# EAGLE design StickLogger (EAGLE 7.2.0)
CNAME: µArduino; CREVISION: 1.0; DATE: 28.04.2015; DESIGNER: Prajwal Bhattaram
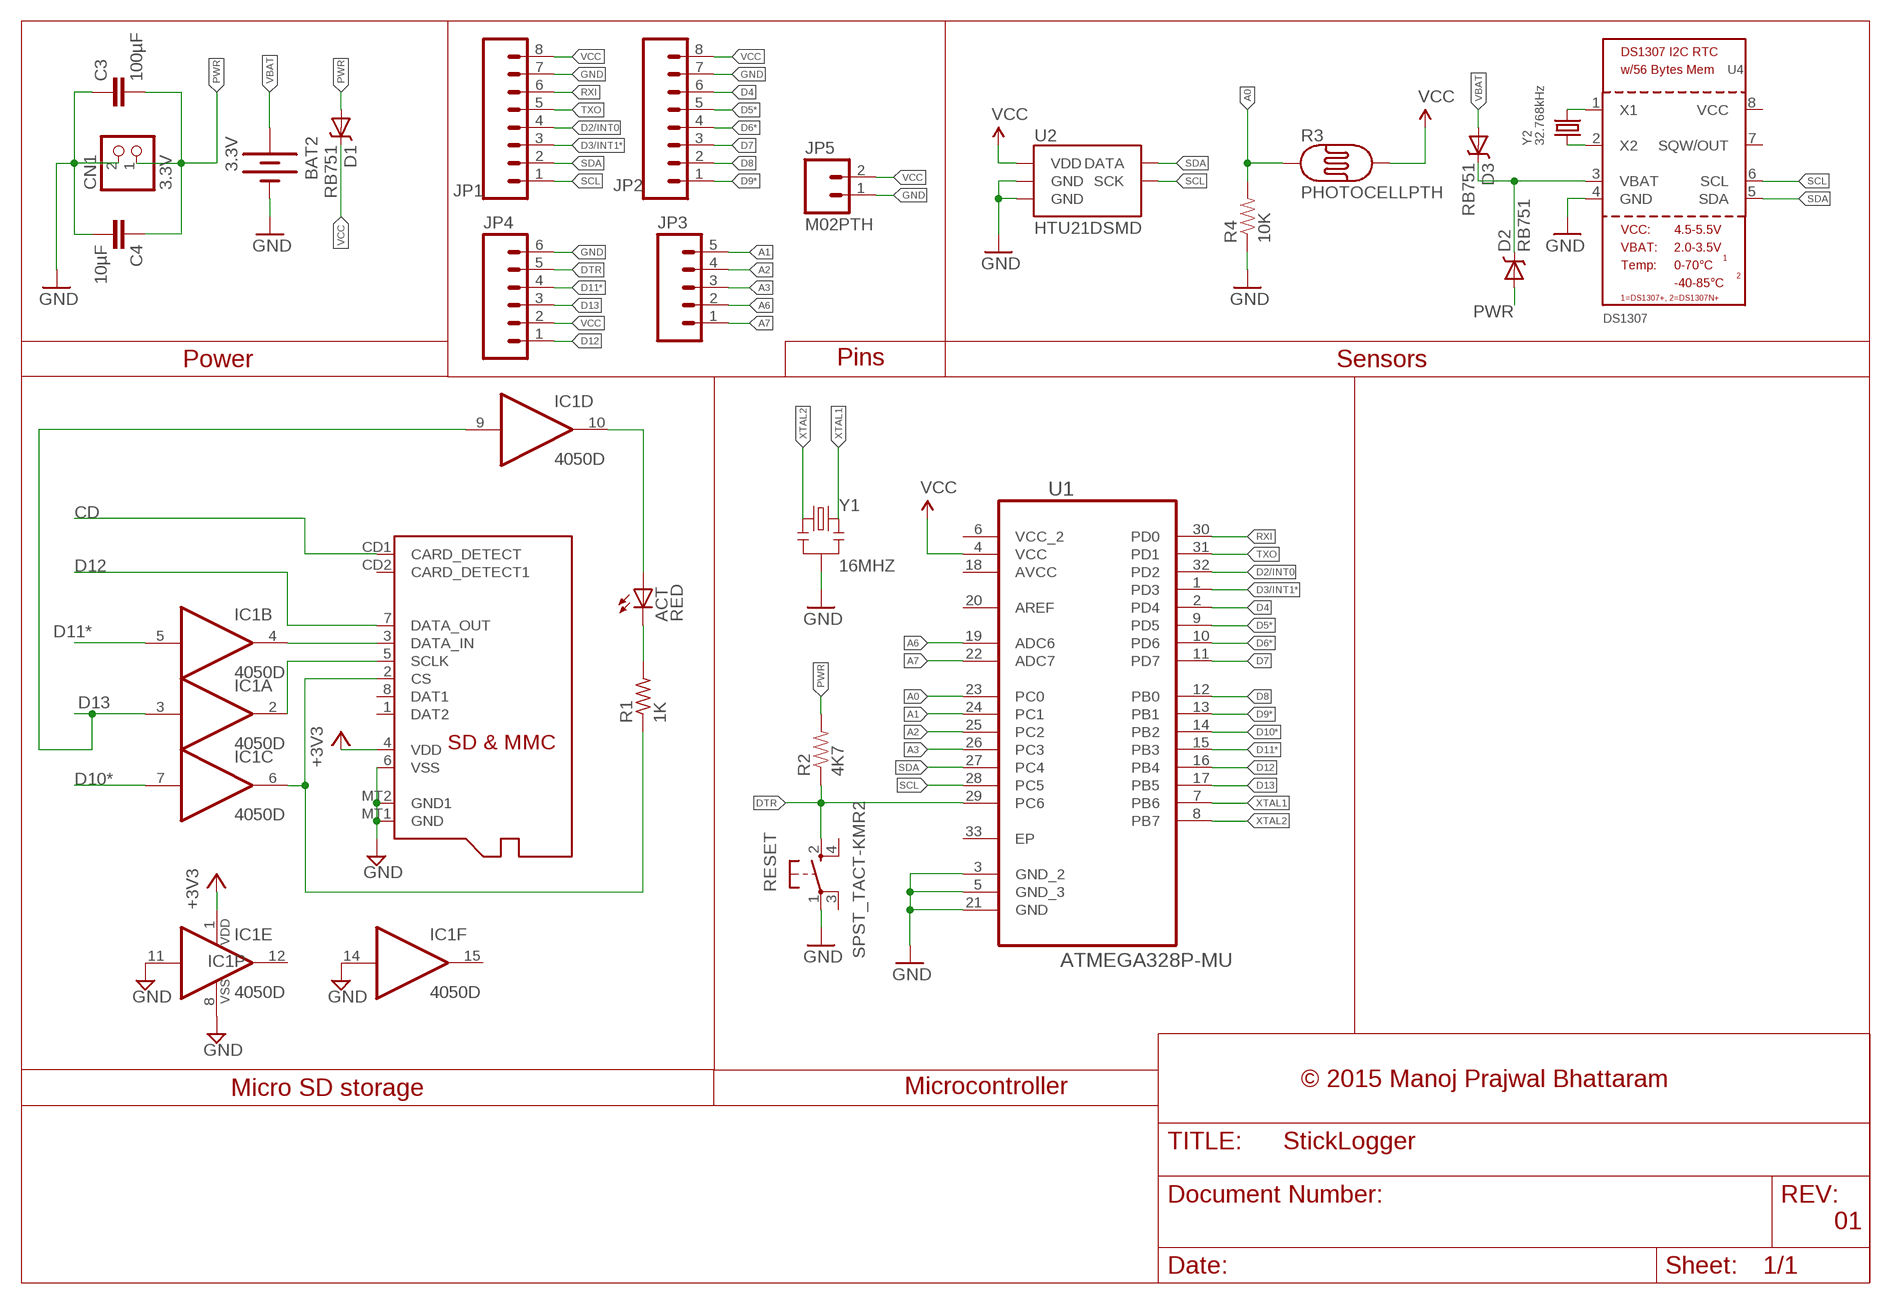
[diagram p0: schematic, sheet 1]

## Parts
ACT  RED  LEDCHIP-LED0805  [CHIP-LED0805]
BAT2  3.3V  BATTERY12MM  [BATTCON_12MM]
C3  100µF  CAP0402-CAP  [0402-CAP]
C4  10µF  CAP0402-CAP  [0402-CAP]
CN1  3.3V  JST_2PIN-SMT-RA  [JST-PH-2-SMT-RA]
D1  RB751  DIODE-SCHOTTKY-RB751  [SOD-523]
D2  RB751  DIODE-SCHOTTKY-RB751  [SOD-523]
D3  RB751  DIODE-SCHOTTKY-RB751  [SOD-523]
IC1  4050D  [SO16]
JP1  M08NO_SILK  [1X08_NO_SILK]
JP2  M08NO_SILK  [1X08_NO_SILK]
JP3  M05NO_SILK  [1X05_NO_SILK]
JP4  M06SMD  [1X06-SMD]
JP5  M02PTH  [1X02]
R1  1K  R-US_R0805  [R0805]
R2  4K7  RESISTOR0402-RES  [0402-RES]
R3  PHOTOCELLPTH  [PHOTOCELL]
R4  10K  RESISTOR0402-RES  [0402-RES]
RESET  SPST_TACT-KMR2  [KMR2]
U1  ATMEGA328P-MU  [QFN50P500X500X100-33N]
U2  HTU21DSMD  [HTU21D]
U4  DS1307  RTC_DS1307  [SOIC8_150MIL]
X1  MICROSD  [MICROSD]
Y1  16MHZ  RESONATOR16MHZ  [RESONATOR-SMD]
Y2  32.768kHz  CRYSTAL32-SMD  [CRYSTAL-32KHZ-SMD]

## Nets
3V: D2.C D3.C U4.3(VBAT)
+3V3: IC1.1(P:VDD) X1.4(VDD)
A0: R3.1 R4.2 U1.23(PC0)
A1: JP3.5 U1.24(PC1)
A2: JP3.4 U1.25(PC2)
A3: JP3.3 U1.26(PC3)
A6: JP3.2 U1.19(ADC6)
A7: JP3.1 U1.22(ADC7)
CD: X1.CD1(CARD_DETECT)
D2/INT0: JP1.4 U1.32(PD2)
D3/INT1*: JP1.3 U1.1(PD3)
D4: JP2.6 U1.2(PD4)
D5*: JP2.5 U1.9(PD5)
D6*: JP2.4 U1.10(PD6)
D7: JP2.3 U1.11(PD7)
D8: JP2.2 U1.12(PB0)
D9*: JP2.1 U1.13(PB1)
D10*: IC1.7(C:I) U1.14(PB2)
D11*: IC1.5(B:I) JP4.4 U1.15(PB3)
D12: JP4.1 U1.16(PB4) X1.7(DATA_OUT)
D13: IC1.3(A:I) IC1.9(D:I) JP4.3 U1.17(PB5)
DTR: JP4.5 R2.1 RESET.2(S) U1.29(PC6)
GND: BAT2.GND(-) C3.1 C4.2 CN1.2 IC1.8(P:VSS) IC1.11(E:I) IC1.14(F:I) JP1.7 JP2.7 JP4.6 JP5.1 R4.1 RESET.1(P) U1.3(GND_2) U1.5(GND_3) U1.21(GND) U2.7(GND) U2.GND U4.4(GND) X1.6(VSS) X1.MT1(GND) X1.MT2(GND1) Y1.2
N$1: ACT.A IC1.10(D:O)
N$2: IC1.2(A:O) X1.5(SCLK)
N$3: IC1.6(C:O) R1.1 X1.2(CS)
N$4: ACT.C R1.2
N$5: IC1.4(B:O) X1.3(DATA_IN)
N$6: U4.2(X2) Y2.X1
N$7: U4.1(X1) Y2.X2
PWR: C3.2 C4.1 CN1.1 D1.A D2.A R2.2
RXI: JP1.6 U1.30(PD0)
SCL: JP1.1 U1.28(PC5) U2.SCK U4.6(SCL)
SDA: JP1.2 U1.27(PC4) U2.DATA U4.5(SDA)
TXO: JP1.5 U1.31(PD1)
VBAT: BAT2.PWR@1(+) D3.A
VCC: D1.C JP1.8 JP2.8 JP4.2 JP5.2 R3.2 U1.4(VCC) U2.VDD
XTAL1: U1.7(PB6) Y1.3
XTAL2: U1.8(PB7) Y1.1
Unconnected: IC1.12(E:O) IC1.15(F:O) RESET.3(P1) RESET.4(S1) U1.20(AREF) U1.33(EP) U4.7(SQW/OUT) U4.8(VCC) X1.1(DAT2) X1.8(DAT1) X1.CD2(CARD_DETECT1)

## Notes on the sheet
- Power | Pins | Sensors
- © 2015 Manoj Prajwal Bhattaram
- Micro SD storage | Microcontroller
- 01

## Power pins joined to a net without a drawn wire
AVCC: U1.18(AVCC)
VCC_2: U1.6(VCC_2)

## Library data of the parts
ACT = adafruit:LED: LED OSRAM: - CHIPLED LG R971, LG N971, LY N971, LG Q971, LY Q971, LO R971, LY R971 LH N974, LH R974 LS Q976, LO Q976, LY Q976 LO Q996 - Hyper CHIPLED LW Q18S LB Q993, LB Q99A, LB R99A - SideLED LS A670, LO A670, LY A670, LG A670, LP A670 LB A673, LV A673, LT A673, LW A673 LH A674 LY A675 LS A676, LA A676, LO A676, LY A676, LW A676 LS A679, LY A679, LG A679 - Hyper Micro SIDELED® LS Y876, LA Y876, LO Y876, LY Y876 LT Y87S - SmartLED LW L88C, LW L88S LB L89C, LB L89S, LG L890 LS L89K, LO L89K, LY L89K LS L896, LA L896, LO L896, LY L896 - TOPLED LS T670, LO T670, LY T670, LG T670, LP T670 LSG T670, LSP T670, LSY T670, LOP T670, LYG T670 LG T671, LOG T671, LSG T671 LB T673, LV T673, LT T673, LW T673 LH T674 LS T676, LA T676, LO T676, LY T676, LB T676, LH T676, LSB T676, LW T676 LB T67C, LV T67C, LT T67C, LS T67K, LO T67K, LY T67K, LW E67C LS E67B, LA E67B, LO E67B, LY E67B, LB E67C, LV E67C, LT E67C LW T67C LS T679, LY T679, LG T679 LS T770, LO T770, LY T770, LG T770, LP T770 LB T773, LV T773, LT T773, LW T773 LH T774 LS E675, LA E675, LY E675, LS T675 LS T776, LA T776, LO T776, LY T776, LB T776 LHGB T686 LT T68C, LB T68C - Hyper Mini TOPLED® LB M676 - Mini TOPLED Santana® LG M470 LS M47K, LO M47K, LY M47K Source: http://www.osram.convergy.de/
BAT2 = SparkFun-Electromechanical:BATTERY: Battery Holders Various common sizes : AA, AAA, 20mm coin cell and 12mm coin cell. 20MM_4LEGS, BATT-10373
C3 C4 = SparkFun-Capacitors:CAP: Capacitor Standard 0603 ceramic capacitor, and 0.1" leaded capacitor.
CN1 = adafruit:JST_2PIN: JST 2-Pin Connectors of various flavors SMT-RA (S2B-PH-SM4) 4UConnector #17311 SMT (B2B-PH-SM4) THM-RA (S2B-PH) THM (B2B-PH)
D1-D3 = SparkFun-DiscreteSemi:DIODE-SCHOTTKY: Schottky diodes in SFE's production catalog BAT20J 1A 23V 0.62Vf RB751 120mA 40V 0.37Vf PMEG4005EJ 0.5A 40V 0.42Vf MBRA140 1A 40V 0.5Vf B340A 3A 40V SMA; PROD_ID: DIO-11018
IC1 = 40xx:4050: Hex non-inverting BUFFER
JP1 JP2 = SparkFun-Connectors:M08: Header 8 Standard 8-pin 0.1" header. Use with straight break away headers (SKU : PRT-00116), right angle break away headers (PRT-00553), swiss pins (PRT-00743), machine pins (PRT-00117), and female headers (PRT-00115).
JP3 = SparkFun-Connectors:M05: Header 5 Standard 5-pin 0.1" header. Use with straight break away headers (SKU : PRT-00116), right angle break away headers (PRT-00553), swiss pins (PRT-00743), machine pins (PRT-00117), and female headers (PRT-00115). Molex polarized connector foot print use with SKU : PRT-08230 with associated crimp pins and housings.
JP4 = SparkFun-Connectors:M06: Header 6 Standard 6-pin 0.1" header. Use with straight break away headers (SKU : PRT-00116), right angle break away headers (PRT-00553), swiss pins (PRT-00743), machine pins (PRT-00117), and female headers (PRT-00115). Molex polarized connector foot print use with SKU : PRT-08094 with associated crimp pins and housings. NOTES ON THE VARIANTS LOCK and LOCK_LONGPADS... This footprint was designed to help hold the alignment of a through-hole component (i.e. 6-pin header) while soldering it into place. You may notice that each hole has been shifted either up or down by 0.005 of an inch from it's more standard position (which is a perfectly straight line). This slight alteration caused the pins (the squares in the middle) to touch the edges of the holes. Because they are alternating, it causes a "brace" to hold the component in place. 0.005 has proven to be the perfect amount of "off-center" position when using our standard breakaway headers. Although looks a little odd when you look at the bare footprint, once you have a header in there, the alteration is very hard to notice. Also,if you push a header all the way into place, it is covered up entirely on the bottom side. This idea of altering the position of holes to aid alignment will be further integrated into the Sparkfun Library for other footprints. It can help hold any component with 3 or more connection pins.
JP5 = SparkFun-Connectors:M02: Standard 2-pin 0.1" header. Use with - straight break away headers ( PRT-00116) - right angle break away headers (PRT-00553) - swiss pins (PRT-00743) - machine pins (PRT-00117) - female headers (PRT-00115) Molex polarized connector foot print use with: PRT-08233 with associated crimp pins and housings. 2.54_SCREWTERM for use with PRT-10571. 3.5mm Screw Terminal footprints for PRT-08084 5mm Screw Terminal footprints for use with PRT-08433
R1 = adafruit:R-US_: RESISTOR, American symbol
R2 R4 = SparkFun-Passives:RESISTOR: Resistor Basic schematic elements and footprints for 0603, 1206, and PTH resistors.
R3 = SparkFun-Sensors:PHOTOCELL: CdS photoresistor. This is a low cost way to detect light levels. Resistance decreases with more incoming light. SparkFun SKU: SEN-09088
RESET = adafruit:SPST_TACT: SMT 6mm switch, EVQQ2 series http://www.ladyada.net/library/eagle
U1 = Atmel:ATMEGA328P-MU: Programmable Flash; MPN: ATMEGA328P-MU; OC_FARNELL: 1748522; OC_NEWARK: 26R2526; PACKAGE: QFN-32; SUPPLIER: Atmel
U2 = SparkFun-Sensors:HTU21D
U4 = microbuilder:RTC_DS1307: DS1307 I2C RTC with 56-Bytes RAM
X1 = adafruit:MICROSD: Micro-SD / Transflash card holder with SPI pinout For the 3M # 2908-05WB-MG and/or 4UCON #19656 push-push type
Y1 = SparkFun-FreqCtrl:RESONATOR: Resonator Small SMD resonator. Used, eg, on the Arduino Pro/ Pro Mini boards. 8MHz- XTAL-08895 16MHz- XTAL-08900; PROD_ID: XTAL-08900
Y2 = SparkFun-FreqCtrl:CRYSTAL: Various standard crystals. Proven footprints. Spark Fun Electronics SKU : COM-00534; PROD_ID: XTAL-07894

## Board
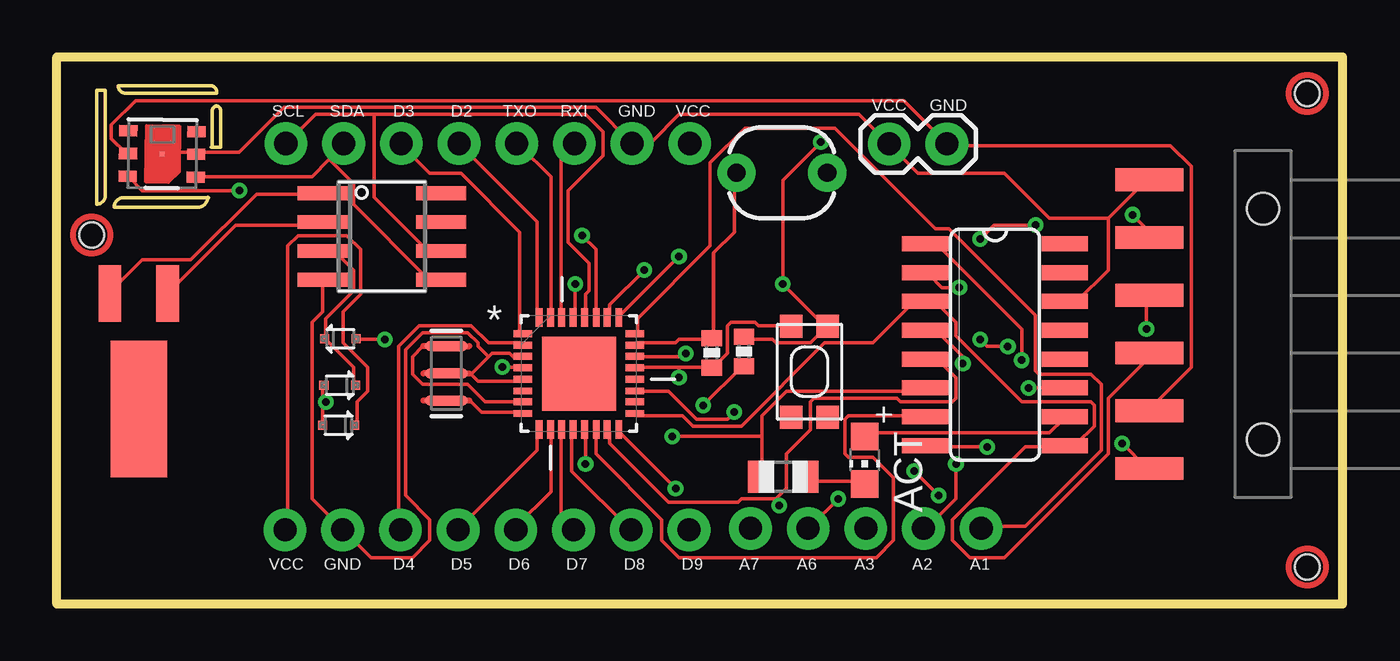
[diagram p1: board, top side]
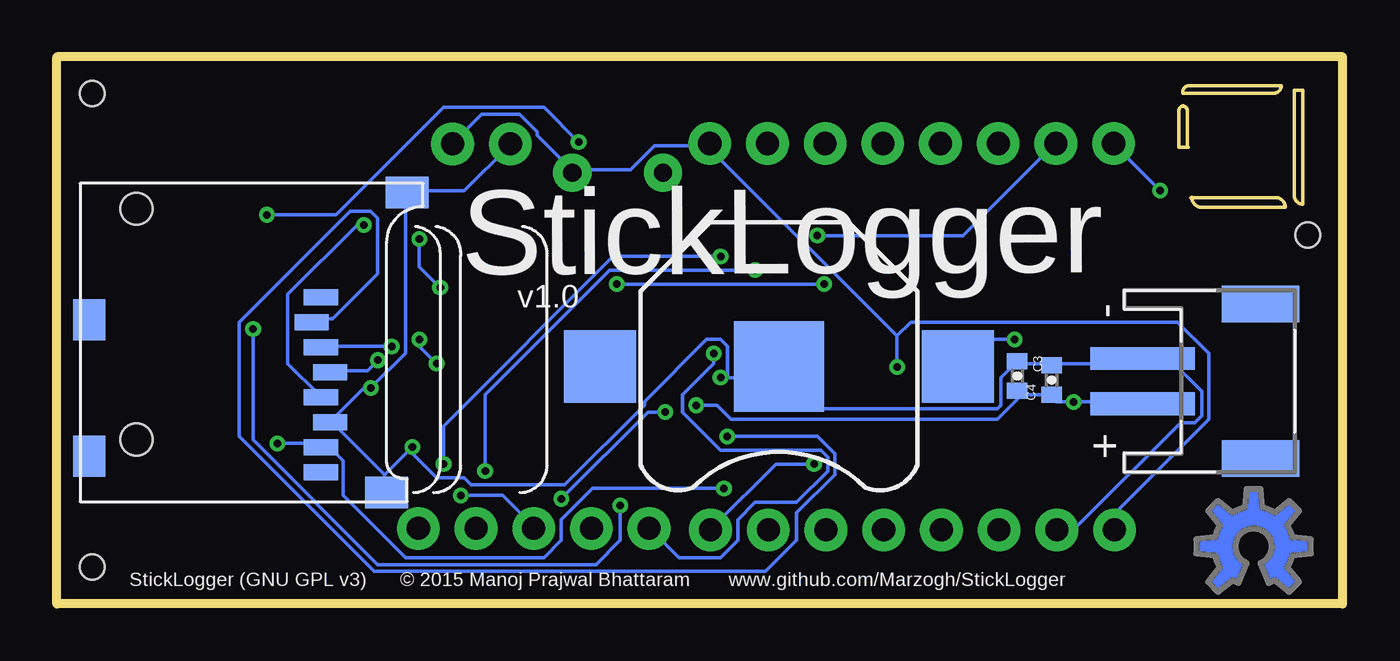
[diagram p2: board, bottom side, seen from below]

Size 56.61 x 24.07 mm. Coordinates in mm from the lower left corner, seen from the top.
Outline: 6.84,20.11 6.84,21.67 arc-90 7.02,21.91 arc-90 7.21,21.73 7.21,20.14
Outline: 6.65,17.89 arc-90 6.21,17.45 2.52,17.45 arc-90 2.95,17.87 6.68,17.87
Outline: 7.04,22.53 arc90 6.77,22.8 2.7,22.8 arc90 3.04,22.47 7.04,22.47
Outline: 1.78,22.6 arc90 1.77,22.59 1.77,17.59 arc90 2.13,17.95 2.13,22.59 arc90 2.12,22.6 1.77,22.6
Outline: 6.8,20.1 7.21,20.1
Outline: 0,0 56.61,0 56.61,24.07 0,24.07 0,0
Copper layers (1*16): Top 0.0356mm / dielectric 1.5011mm / Bottom 0.0356mm
Design rules "OSH Park Design guidelines": minimum track width 6mil, minimum drill 13mil, track to track 6mil, track to pad 6mil, pad to pad 6mil, via to via 6mil, smd to smd 6mil, copper to edge 15mil, drill to drill 6mil, minimum pad ring 7mil, minimum via ring 7mil, stop-mask expansion 3mil, vias tented up to drill 0mil, thermal gap 10mil
Holes 1.1 mm at 55.05,1.62 55.05,22.45 1.53,16.23

### Footprints (pad centres in the part's own frame; a part is rotated, then mirrored left to right if it is on the bottom)
CHIP-LED0805 = smd 1.2 x 1.2: A 0,-1.05; C 0,1.05
BATTCON_12MM = smd 3.962 x 3.962: GND 0,0 | smd 3.175 x 3.175: PWR@1 -7.874,0; PWR@2 7.874,0
0402-CAP = smd 0.7 x 0.9: 1 -0.65,0; 2 0.65,0
JST-PH-2-SMT-RA = smd 1 x 4.6: 1 1,-3.7; 2 -1,-3.7 | smd 1.6 x 3.4: NC1 -3.4,1.5; NC2 3.4,1.5
SOD-523 = smd 0.4 x 0.4: A -0.7,0; C 0.7,0
SO16 = smd 0.66 x 2.032: 1 -4.445,-3.073; 2 -3.175,-3.073; 3 -1.905,-3.073; 4 -0.635,-3.073; 5 0.635,-3.073; 6 1.905,-3.073; 7 3.175,-3.073; 8 4.445,-3.073; 9 4.445,3.073; 10 3.175,3.073; 11 1.905,3.073; 12 0.635,3.073; 13 -0.635,3.073; 14 -1.905,3.073; 15 -3.175,3.073; 16 -4.445,3.073
1X08_NO_SILK = drill 1.016 pad 1.88: 1 0,0; 2 2.54,0; 3 5.08,0; 4 7.62,0; 5 10.16,0; 6 12.7,0; 7 15.24,0; 8 17.78,0
1X05_NO_SILK = drill 1.016 pad 1.88: 1 0,0; 2 2.54,0; 3 5.08,0; 4 7.62,0; 5 10.16,0
1X06-SMD = smd 1 x 3: 1 -6.35,5; 2 -3.81,5; 3 -1.27,5; 4 1.27,5; 5 3.81,5; 6 6.35,5 | hole 1.4: -5.08,0; 5.08,0
1X02 = drill 1.016 pad 1.88: 1 0,0; 2 2.54,0
R0805 = smd 1.1 x 1.4: 1 -1,0; 2 1,0
0402-RES = smd 0.7 x 0.9: 1 -0.65,0; 2 0.65,0
PHOTOCELL = drill 0.8 pad 1.676: 1 -2,0; 2 2,0
KMR2 = smd 1 x 1: 1 2,0.8; 2 2,-0.8; 3 -2,0.8; 4 -2,-0.8
QFN50P500X500X100-33N = smd 0.813 x 0.305: 1 -2.464,1.753; 2 -2.464,1.245; 3 -2.464,0.762; 4 -2.464,0.254; 5 -2.464,-0.254; 6 -2.464,-0.762; 7 -2.464,-1.245; 8 -2.464,-1.753; 17 2.464,-1.753; 18 2.464,-1.245; 19 2.464,-0.762; 20 2.464,-0.254; 21 2.464,0.254; 22 2.464,0.762; 23 2.464,1.245; 24 2.464,1.753 | smd 0.305 x 0.813: 9 -1.753,-2.464; 10 -1.245,-2.464; 11 -0.762,-2.464; 12 -0.254,-2.464; 13 0.254,-2.464; 14 0.762,-2.464; 15 1.245,-2.464; 16 1.753,-2.464; 25 1.753,2.464; 26 1.245,2.464; 27 0.762,2.464; 28 0.254,2.464; 29 -0.254,2.464; 30 -0.762,2.464; 31 -1.245,2.464; 32 -1.753,2.464 | smd 3.251 x 3.251: 33 0,0
HTU21D = smd 0.2 x 0.2: 7 0,0 | smd 0.8 x 0.5: DATA 1.5,-1; GND 1.5,0; NC@1 -1.5,1; NC@6 1.5,1; SCK -1.5,-1; VDD -1.5,0
SOIC8_150MIL = smd 0.6 x 2.2: 1 -1.905,-2.6; 2 -0.635,-2.6; 3 0.635,-2.6; 4 1.905,-2.6; 5 1.905,2.6; 6 0.635,2.6; 7 -0.635,2.6; 8 -1.905,2.6
MICROSD = smd 0.7 x 1.5: 1 9,-10.64; 2 7.9,-10.24; 3 6.8,-10.64; 4 5.7,-11.04; 5 4.6,-10.64; 6 3.5,-11.04; 7 2.4,-10.64; 8 1.3,-10.64 | smd 1.8 x 1.4: CD1 2,-0.44; CD2 8,-0.44 | smd 1.4 x 1.9: MT1 0.4,-13.54; MT2 13.6,-14.44
RESONATOR-SMD = smd 0.45 x 1.905: 1 -1.2,0; 2 0,0; 3 1.2,0
CRYSTAL-32KHZ-SMD = smd 2.5 x 6: SHEILD 0,5.08 | smd 1 x 2.5: X1 -1.27,0; X2 1.27,0

### Placement (x,y rotation side)
ACT  35.57,6.32 180 top
BAT2  24.81,10.44 180 bottom
C3  14.33,10.02 270 bottom
C4  12.82,9.84 90 bottom
CN1  5.11,9.8 270 bottom
D1  12.4,7.86 0 top
D2  12.46,9.62 0 top
D3  12.48,11.66 180 top
IC1  41.3,11.4 270 top
JP1  10.09,20.25 0 top
JP2  27.83,3.25 180 top
JP3  30.53,3.32 0 top
JP4  53.1,12.31 90 top
JP5  36.64,20.24 0 top
R1  31.98,5.58 0 top
R2  30.25,11.1 270 top
R3  31.92,18.97 0 top
R4  28.83,11.04 90 top
RESET  33.13,10.21 90 top
U1  22.99,10.13 0 top
U2  4.64,19.8 359.2 top
U4  14.31,16.16 270 top
U$1  [OSHWLOGO_TOP_0.2]  3.92,2.52 0 bottom
X1  55.62,4.49 90 bottom
Y1  17.15,10.14 90 top
Y2  3.62,13.65 180 top

### Tracks (layer width: path | path; a pad name or v marks a point on that pad's centre or on a via)
3V
  Top 0.152: D2.C 13.07,9.65 13.07,10.41 11.85,11.63 D3.C 11.85,11.78 11.85,12.55 13.07,13.76 13.07,14.68 12.3,15.44 11.85,15.44 U4.3
+3V3  (via drill 0.33)
  Top 0.152: v42.48,10.72 42.48,12.09 38.82,15.75 38.36,15.75 IC1.1
  Bottom 0.152: v42.48,10.72 42.94,10.26 44.46,10.26 X1.4
A0
  Top 0.152: U1.23 25.56,11.48 27.24,11.48 27.39,11.63 28.76,11.63 R4.2 28.91,11.78 28.91,15.44 29.83,16.36 29.83,18.95 R3.1
A1
  Top 0.152: U1.24 25.56,11.94 25.56,12.55 28.76,15.75 28.76,19.4 30.29,20.93 34.25,20.93 38.67,16.51 39.28,16.51 43.09,12.7 43.09,10.26 43.24,10.11 45.53,10.11 45.98,9.65 45.98,6.75 42.63,3.4 40.8,3.4 JP3.5
A2  (via drill 0.33)
  Top 0.152: v27.39,15.29 24.8,12.7 U1.25 | v39.58,6.14 39.58,4.62 38.21,3.25 JP3.4
  Bottom 0.152: v27.39,15.29 32.12,15.29 39.58,7.82 v39.58,6.14
A3  (via drill 0.33)
  Top 0.152: v25.87,14.68 24.34,13.16 24.34,12.7 U1.26 | v38.82,4.77 v37.75,5.84
  Bottom 0.152: v25.87,14.68 32.27,14.68 37.75,9.19 v37.75,5.84 | v38.82,4.77 36.99,4.77 35.62,3.4 JP3.3
A6  (via drill 0.33)
  Top 0.152: v29.83,8.43 29.52,8.13 28.15,8.13 26.93,9.35 25.56,9.35 U1.19 | v34.4,4.62 33.18,3.4 JP3.2
  Bottom 0.152: v29.83,8.43 30.59,8.43 v34.4,4.62
A7  (via drill 0.33)
  Top 0.152: v27.7,11.02 27.54,10.87 25.56,10.87 U1.22
  Bottom 0.152: v27.7,11.02 27.7,10.56 29.07,9.19 29.07,8.43 27.39,6.75 22.97,6.75 22.67,6.45 22.67,5.84 24.04,4.47 25.87,4.47 26.63,3.71 26.63,2.79 27.39,2.03 29.22,2.03 30.44,3.25 JP3.1
D2/INT0
  Top 0.152: U1.32 21.14,12.7 21.14,16.81 17.79,20.17 JP1.4
D3/INT1*
  Top 0.152: U1.1 20.38,11.94 20.38,16.36 17.79,18.95 16.42,18.95 15.2,20.17 JP1.3
D4
  Top 0.152: U1.2 20.38,11.48 19.01,11.48 18.25,12.24 15.96,12.24 15.05,11.33 15.05,3.4 JP2.6
D5*
  Top 0.152: U1.9 21.14,7.52 21.14,6.75 17.79,3.4 JP2.5
D6*
  Top 0.152: U1.10 21.75,7.52 21.75,4.93 20.23,3.4 JP2.4
D7
  Top 0.152: U1.11 22.21,7.52 22.21,3.86 22.67,3.4 JP2.3
D8
  Top 0.152: U1.12 22.67,7.52 22.67,5.84 25.26,3.25 JP2.2
D9*  (via drill 0.33)
  Top 0.152: v23.28,6.14 23.28,7.52 U1.13
  Bottom 0.152: v23.28,6.14 24.95,6.14 27.7,3.4 JP2.1
D10*
  Top 0.152: U1.14 23.73,7.52 23.73,6.6 26.63,3.71 26.63,2.79 27.39,2.03 36.08,2.03 36.84,2.79 36.84,5.54 35.93,6.45 34.86,6.45 34.71,6.6 34.71,8.13 34.86,8.28 38.21,8.28 IC1.7
D11*  (via drill 0.33)
  Top 0.152: 31.51,4.62 31.66,4.62 32.12,5.08 32.12,6.6 33.18,7.67 33.18,8.89 33.33,9.04 36.99,9.04 37.14,8.89 39.43,8.89 39.58,9.04 39.58,9.95 38.82,10.72 38.36,10.72 IC1.5 | 31.51,4.62 30.13,4.62 29.98,4.47 26.93,4.47 24.34,7.06 24.34,7.52 U1.15 | v47.96,12.09 47.96,13.46 JP4.4 | 31.51,4.62 v31.81,4.32
  Bottom 0.152: v47.96,12.09 47.96,7.21 42.48,1.73 32.88,1.73 31.81,2.79 v31.81,4.32
D12  (via drill 0.33)
  Top 0.152: v27.24,5.08 24.8,7.52 U1.16 | v46.9,7.06 47.96,5.99 JP4.1
  Bottom 0.152: v27.24,5.08 33.03,5.08 34.4,3.71 34.4,2.79 35.16,2.03 41.26,2.03 44,4.77 44,6.3 44.46,6.75 44.92,6.75 X1.7 45.07,6.91 45.22,7.06 v46.9,7.06
D13
  Top 0.152: U1.17 25.56,8.28 27.54,8.28 28,7.82 30.13,7.82 33.79,11.48 35.93,11.48 37.6,13.16 38.21,13.16 IC1.3 38.36,13.16 38.82,13.16 39.58,12.39 39.58,11.78 42.48,8.89 45.53,8.89 45.68,8.74 45.68,7.82 44.92,7.06 44.46,7.06 IC1.9 44.31,6.91 42.63,6.91 39.43,3.71 39.43,2.79 40.19,2.03 41.72,2.03 46.29,6.6 46.29,9.04 47.96,10.72 47.96,11.02 JP4.3
DTR  (via drill 0.33)
  Top 0.152: v22.82,14.07 22.82,12.7 U1.29 | R2.1 30.29,11.63 31.51,11.63 31.66,11.48 33.18,11.48 33.79,12.09 RESET.2 33.79,12.24 v31.96,14.07 31.96,18.64 v33.64,20.32 | v47.36,17.12 47.96,16.51 47.96,16.2 JP4.5
  Bottom 0.152: v31.96,14.07 v22.82,14.07 | v47.36,17.12 44.31,17.12 39.58,21.84 35.16,21.84 v33.64,20.32
GND  (via drill 0.33)
  Top 0.152: 18.25,10.11 18.55,9.8 20.38,9.8 U1.5 | 18.25,10.11 19.01,10.87 | 19.01,10.87 19.16,11.02 19.92,11.02 20.08,10.87 20.38,10.87 U1.3 | 18.25,10.11 Y1.2 | 19.01,10.87 18.55,11.33 18.55,11.48 18.09,11.94 16.11,11.94 15.35,11.17 15.35,4.77 16.42,3.71 16.42,2.79 15.66,2.03 13.83,2.03 12.61,3.25 JP2.7 12.46,3.4 11.24,4.62 11.24,12.39 11.69,12.85 11.69,14.22 U4.4 | 27.39,10.41 28.76,10.41 R4.1 28.91,10.41 29.52,11.02 29.52,12.24 29.68,12.39 30.74,12.39 30.9,12.24 32.27,12.24 RESET.1 | 27.39,10.41 25.56,10.41 U1.21 | v27.39,9.95 27.39,10.41 | U2.7 4.68,19.86 6.05,19.86 U2.GND 6.21,19.86 8.04,19.86 10.02,21.84 23.73,21.84 25.26,20.32 JP1.7 25.41,20.32 26.17,20.32 27.39,21.54 35.32,21.54 36.53,20.32 JP5.1 36.69,20.17 37.91,18.95 41.72,18.95 43.7,16.97 46.29,16.97 | 46.29,16.97 46.29,14.68 44.92,13.31 44.46,13.31 IC1.14 | 46.29,16.97 47.96,18.64 JP4.6 | v40.95,6.91 38.36,6.91 IC1.8 | v42.78,9.5 44.31,9.5 IC1.11
  Bottom 0.152: 27.09,9.95 25.41,9.95 24.95,10.41 BAT2.GND 24.8,10.41 22.97,8.58 15.2,8.58 15.05,8.74 15.05,9.95 14.44,10.56 C3.1 14.28,10.56 12.91,10.56 C4.2 12.76,10.56 9.1,10.56 8.95,10.72 CN1.2 8.8,10.72 7.58,10.72 6.21,9.35 6.21,8.28 6.51,7.97 7.12,7.97 11.69,3.4 12.46,3.4 JP2.7 | JP5.1 36.69,20.17 38.67,18.18 41.11,18.18 X1.MT2 41.26,18.03 41.26,11.02 v42.78,9.5 43.09,9.5 44.46,8.13 X1.6 44.46,7.97 42.17,5.69 | 42.17,5.69 42.17,4.93 X1.MT1 | 42.17,5.69 41.11,6.75 | 27.09,9.95 27.09,11.33 27.39,11.63 28,11.63 30.74,8.89 30.74,8.74 34.25,5.23 38.36,5.23 38.67,5.54 39.89,5.54 41.11,6.75 | 27.09,9.95 v27.39,9.95 | 41.11,6.75 v40.95,6.91
N$1
  Top 0.152: ACT.A 35.62,7.52 43.7,7.52 44.31,8.13 IC1.10
N$2  (via drill 0.33)
  Top 0.152: v43.09,16.66 41.26,16.66 v40.65,16.05 | v39.74,13.92 38.97,13.92 38.36,14.53 IC1.2
  Bottom 0.152: v43.09,16.66 43.39,16.66 46.44,13.61 46.44,10.56 45.07,9.19 X1.5 | v40.65,16.05 40.65,14.83 v39.74,13.92
N$3  (via drill 0.33)
  Top 0.152: 31.05,7.36 31.05,8.28 32.12,9.35 38.21,9.35 IC1.6 | 31.05,7.36 31.05,5.69 R1.1 | 31.05,7.36 v27.09,7.36
  Bottom 0.152: v27.09,7.36 23.12,7.36 22.36,6.6 22.36,5.69 24.04,4.01 24.04,2.79 25.41,1.42 42.63,1.42 48.57,7.36 48.57,12.39 43.7,17.27 42.78,17.27 42.48,16.97 42.48,14.53 44.46,12.55 45.37,12.55 X1.2
N$4
  Top 0.152: ACT.C 35.47,5.38 33.18,5.38 33.03,5.54 R1.2
N$5  (via drill 0.33)
  Top 0.152: v41.87,11.33 40.95,11.33 v40.65,11.63 | v39.89,10.56 39.89,10.87 38.82,11.94 38.36,11.94 IC1.4
  Bottom 0.152: v41.87,11.33 44.92,11.33 X1.3 | v40.65,11.63 40.65,11.33 v39.89,10.56
N$6
  Top 0.152: U4.2 11.69,16.66 7.88,16.66 4.99,13.76 Y2.X1
N$7
  Top 0.152: U4.1 11.69,18.03 8.8,18.03 5.9,15.14 3.77,15.14 2.4,13.76 Y2.X2
PWR  (via drill 0.33)
  Top 0.152: 11.69,8.89 11.69,9.5 D2.A | 11.69,8.89 11.69,7.97 D1.A | v28.46,8.74 30.13,10.41 R2.2 | v11.85,8.89 11.69,8.89
  Bottom 0.152: 14.13,9.19 12.91,9.19 C4.1 12.76,9.04 12.61,8.89 v11.85,8.89 8.95,8.89 CN1.1 | 14.13,9.19 14.28,9.35 C3.2 14.13,9.19 | v28.46,8.74 27.54,8.74 26.93,8.13 15.2,8.13 14.13,9.19
RXI
  Top 0.152: U1.30 22.21,12.7 22.21,19.71 22.67,20.17 JP1.6
SCL  (via drill 0.33)
  Top 0.152: v8.04,18.18 3.77,18.18 3.16,18.79 U2.SCK | 13.98,21.54 11.39,21.54 10.17,20.32 JP1.1 | 13.98,21.54 23.28,21.54 24.04,20.78 24.04,19.71 22.51,18.18 22.51,15.9 23.43,14.98 23.43,13.76 23.28,13.61 23.28,12.7 U1.28 | 13.98,21.54 13.98,17.88 16.27,15.59 16.88,15.59 U4.6
  Bottom 0.152: v8.04,18.18 10.02,20.17 JP1.1
SDA  (via drill 0.33)
  Top 0.152: 12,19.56 12.61,20.17 JP1.2 12,19.56 | 12,19.56 11.24,18.79 6.21,18.79 U2.DATA | v23.12,16.2 23.73,15.59 23.73,12.7 U1.27 | 12,19.56 13.07,18.49 13.07,17.57 16.27,14.37 16.88,14.37 U4.5
  Bottom 0.152: v23.12,16.2 16.72,16.2 12.76,20.17 JP1.2
TXO
  Top 0.152: U1.31 21.75,12.7 21.75,18.79 20.38,20.17 JP1.5
VBAT  (via drill 0.33)
  Top 0.152: v14.44,11.63 13.22,11.63 D3.A
  Bottom 0.152: v14.44,11.63 15.81,11.63 16.88,10.56 BAT2.PWR@1
VCC  (via drill 0.33)
  Top 0.152: D1.C 13.22,7.97 13.22,8.89 13.67,9.35 13.67,10.41 12.61,11.48 12.61,12.85 13.37,13.61 13.37,15.59 12.76,16.2 10.63,16.2 10.17,15.75 10.17,3.4 JP2.8 | v19.62,10.41 20.38,10.41 U1.4 | U2.VDD 3.01,19.86 2.4,20.47 2.4,21.08 3.46,22.15 37.3,22.15 39.13,20.32 JP5.2 39.28,20.17 49.03,20.17 49.95,19.25 49.95,10.41 48.12,8.58 JP4.2
  Bottom 0.152: 19.62,11.78 v19.62,10.41 | 28,20.17 19.62,11.78 | 28,20.17 30.29,20.17 31.35,19.1 33.79,19.1 R3.2 33.94,19.1 35.47,20.62 35.47,20.78 36.23,21.54 37.91,21.54 39.13,20.32 JP5.2 | 28,20.17 JP1.8 | 19.62,11.78 19.01,12.39 7.27,12.39 5.9,11.02 5.9,8.13 10.02,4.01 10.02,3.4 JP2.8
XTAL1
  Top 0.152: U1.7 20.38,8.89 18.86,8.89 18.09,9.65 16.11,9.65 15.66,10.11 15.66,10.87 16.11,11.33 16.14,11.34
XTAL2
  Top 0.152: U1.8 20.38,8.43 18.7,8.43 18.25,8.89 Y1.1
(copper drawn outside any net)
  shapes: Top circle x3

### Text on the board
_tsilk: SCL | SDA | D3 | D2 | TXO | RXI | GND | VCC | VCC | GND | VCC | GND | D4 | D5 | D6 | D7 | D8 | D9 | A7 | A6 | A3 | A2 | A1
_bsilk: StickLogger | v1.0 | StickLogger (GNU GPL v3) © 2015 Manoj Prajwal Bhattaram www.github.com/Marzogh/StickLogger